# Altium schematic sheet INPUT.SchDoc
size A4; SheetNumber: 5; SheetTotal: 30
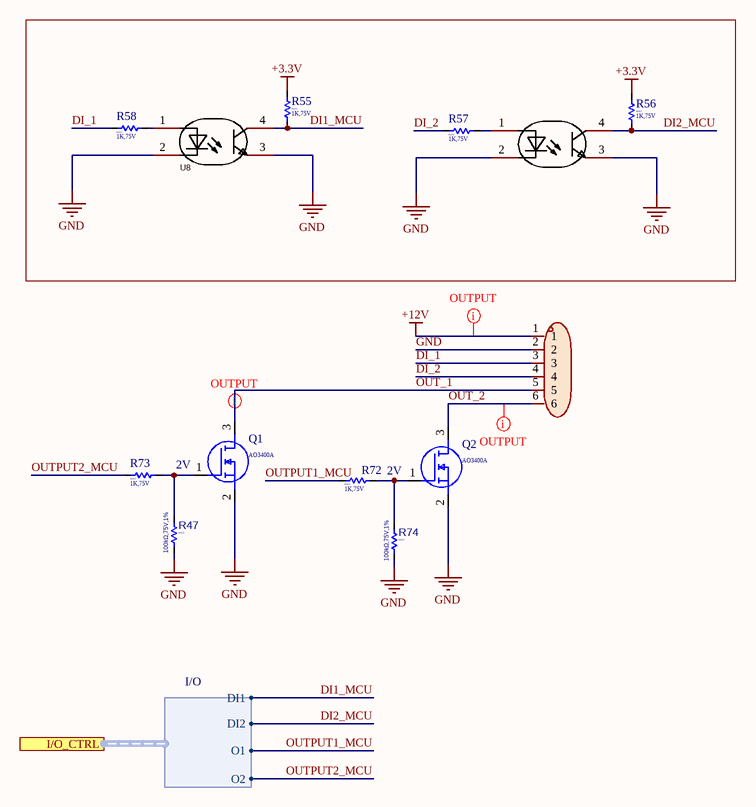
[diagram p0: INPUT.SchDoc]

## Parts
Q1  AO3400A  [SOT95P280X125-3N]
Q2  AO3400A  [SOT95P280X125-3N]
R47  value 100kΩ,75V,1%  Package: 0603  [R0603]  (hidden comment: 100K)
R55  value 1K,75V  Package: 0603  [R0603]  (hidden comment: 1K)
R56  value 1K,75V  Package: 0603  [R0603]  (hidden comment: 1K)
R57  value 1K,75V  Package: 0603  [R0603]  (hidden comment: 1K)
R58  value 1K,75V  Package: 0603  [R0603]  (hidden comment: 1K)
R72  value 1K,75V  Package: 0603  [R0603]  (hidden comment: 1K)
R73  value 1K,75V  Package: 0603  [R0603]  (hidden comment: 1K)
R74  value 100kΩ,75V,1%  Package: 0603  [R0603]  (hidden comment: 100K)
U7  PC817X3NSZ9F  [DIP-4]  (value not drawn)
U8  PC817X3NSZ9F  [DIP-4]  (value not drawn)
U9  DBT50G-6.35-6P-BK-P OGC  [6P_P=6.35mm]  (value not drawn)

## Ports
I/O_CTRL (harness I/O)

## Harnesses
I/O: DI1, DI2, O1, O2

## Nets
+3.3V: R55.2 R56.2
+12V: U9.1
GND: Q1.2(S) Q2.2(S) R47.1 R74.1 U7.2 U7.3 U8.2 U8.3 U9.2
DI1_MCU: R55.1 U8.4 ; port I/O_CTRL.DI1
DI2_MCU: R56.1 U7.4 ; port I/O_CTRL.DI2
DI_1: R58.2 U9.3
DI_2: R57.2 U9.4
OUT_1: Q1.3(D) U9.5
OUT_2: Q2.3(D) U9.6
OUTPUT1_MCU: R72.1 ; port I/O_CTRL.O1
OUTPUT2_MCU: R73.1 ; port I/O_CTRL.O2
NetQ1_1: Q1.1(G) R47.2 R73.2
NetQ2_1: Q2.1(G) R72.2 R74.2
NetR57_1: R57.1 U7.1
NetR58_1: R58.1 U8.1

## Layout directives
net class OUTPUT_NET: +12V, OUT_1, OUT_2

## Notes on the sheet
- 2V

## Library data of the parts
Q1 Q2 = AO3400A: MOSFET N-CH 30V 5.7A SOT23-3L; Manufacturer: Alpha & Omega Semiconductors; Datasheet: https://www.lcsc.com/datasheet/lcsc_datasheet_1811081213_Alpha---Omega-Semicon-AO3400A_C20917.pdf; MPN: AO3400A; LCSC: C20917; Package: SOT-23
R47 R74 = 0603WAF1003T5E: 100mW Thick Film Resistors 75V ±100ppm/℃ ±1% -55℃~+155℃ 100kΩ 0603 Chip Resistor - Surface Mount ROHS; Manufacturer: Royalohm; Type: *; Min Operating Temp: -55; MPN: 0603WAF1003T5E; Datasheet: https://www.mouser.com/datasheet/2/1365/1-3044649.pdf; Max Operating Temp: +125; LCSC: C25803
R55-R58 R72 R73 = 0603WAF1001T5E: 100mW Thick Film Resistors 75V ±100ppm/℃ ±1% 1kΩ 0603 Chip Resistor - Surface Mount ROHS; Manufacturer: UNI-ROYAL(Uniroyal Elec); Datasheet: https://datasheet.lcsc.com/szlcsc/Uniroyal-Elec-0603WAF1001T5E_C21190.pdf; MPN: 0603WAF1001T5E; LCSC: C21190
U7 U8 = PC817X3NSZ9F: Optoisolator Transistor Output 5000Vrms 1 Channel 4-DIP; Manufacturer: SHARP; Forward Voltage: 1.2V; Output Current: 50mA; Reverse Voltage: 6V; Receiving End Voltage: 80V; Number of Outputs: 1; MPN: PC817X3NSZ9F; LCSC: C96006; Package: DIP-4; Datasheet: https://atta.szlcsc.com/upload/public/pdf/source/20180614/C192269_7C74CFE0775652A463AD6B9F912AC892.pdf; Operating Temperature: -30℃~+100℃
U9 = DBT50G-6.35-6P-BK-P OGC: 10A -40℃~+105℃ 300V Black 1x6P Corner Tri-face 22~16 6 1 6.35mm Plugin,P=6.35mm Barrier Terminal Blocks ROHS; Manufacturer: DORABO(地博电气); Supplier Part: C5179475; Manufacturer Part: DBT50G-6.35-6P-BK-P OGC; Supplier Footprint: 插件,P=6.35mm; Datasheet: https://atta.szlcsc.com/upload/public/pdf/source/20230321/4A82F27AE8A2F5607DB8D935518A4E7A.pdf; Operating Temperature Range: -40℃~+105℃